# Altium schematic sheet RF_FrontEnd.SchDoc
size A4; SheetNumber: 4; SheetTotal: 4
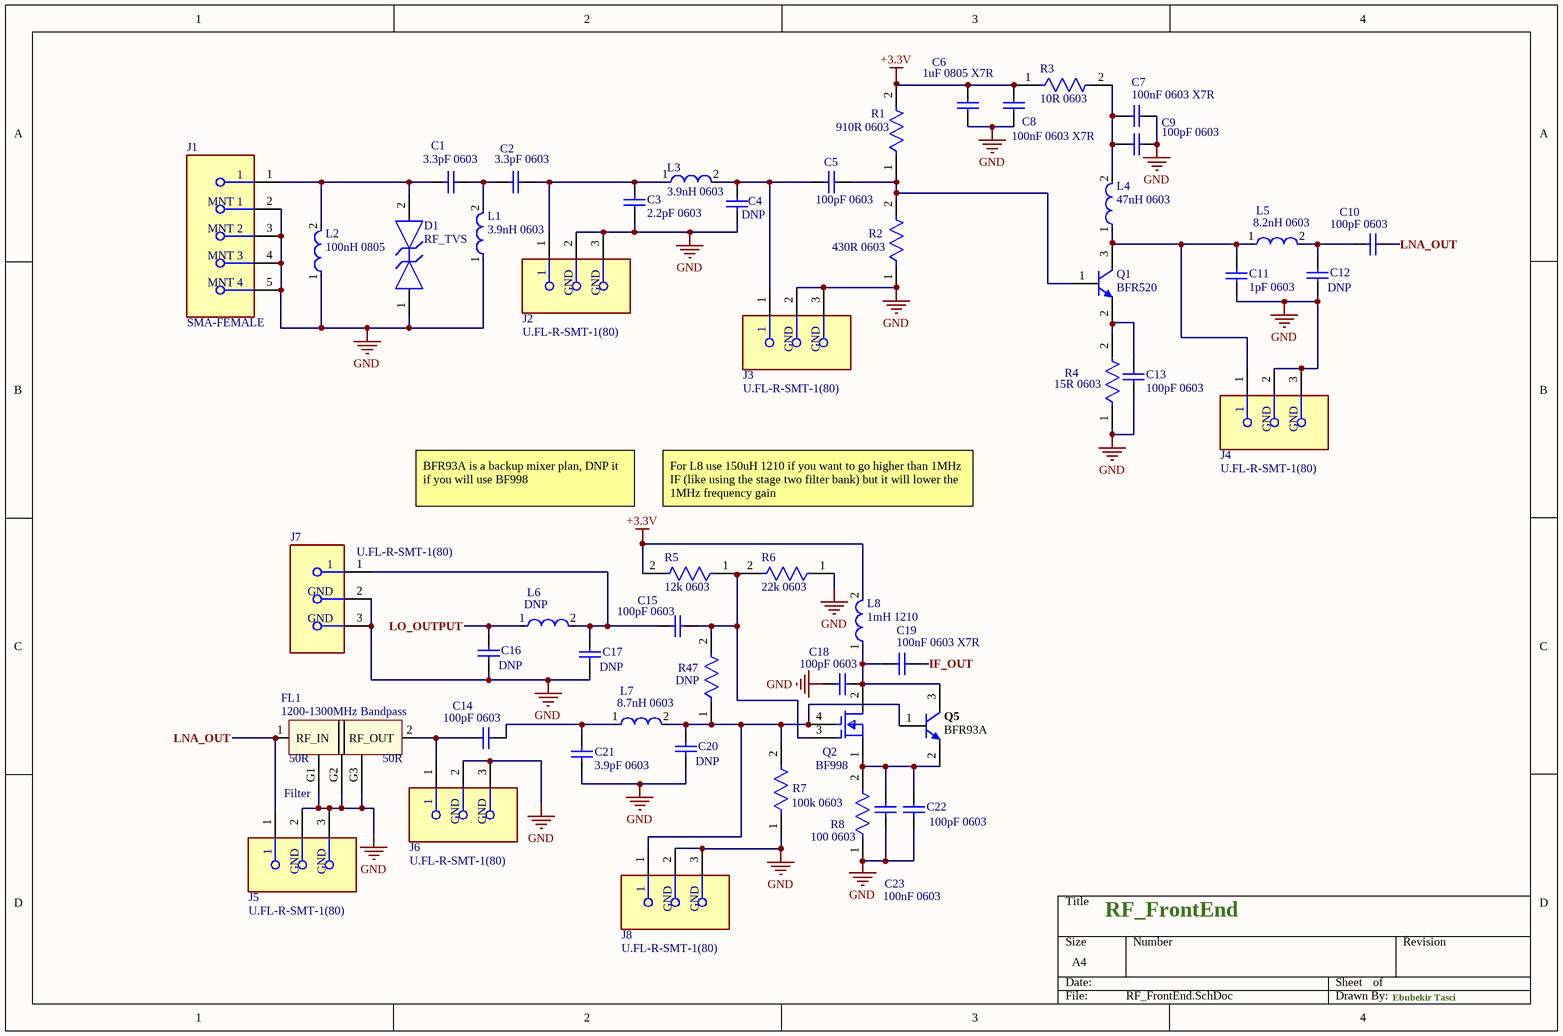
[diagram p0: RF_FrontEnd.SchDoc]

## Parts
C1  3.3pF 0603  [CAPC0603(1608)100_L]
C2  3.3pF 0603  [CAPC0603(1608)100_L]
C3  2.2pF 0603  [CAPC0603(1608)100_L]
C4  DNP  [CAPC0603(1608)100_L]
C5  100pF 0603  [CAPC1608X92X38LL15T08]
C6  1uF 0805 X7R  [CAPC2013X145X50NL20T20]
C7  100nF 0603 X7R  [CAPC1608X92X38NL15T08]
C8  100nF 0603 X7R  [CAPC1608X92X38NL15T08]
C9  100pF 0603  [CAPC1608X92X38LL15T08]
C10  100pF 0603  [CAPC1608X92X38LL15T08]
C11  1pF 0603  [CAPC0603(1608)100_L]
C12  DNP  [CAPC0603(1608)100_L]
C13  100pF 0603  [CAPC1608X92X38LL15T08]
C14  100pF 0603  [CAPC1608X92X38LL15T08]
C15  100pF 0603  [CAPC1608X92X38LL15T08]
C16  DNP  [CAPC0603(1608)100_L]
C17  DNP  [CAPC0603(1608)100_L]
C18  100pF 0603  [CAPC1608X92X38LL15T08]
C19  100nF 0603 X7R  [CAPC1608X92X38NL15T08]
C20  DNP  [CAPC0603(1608)100_L]
C21  3.9pF 0603  [CAPC0603(1608)100_L]
C22  100pF 0603  [CAPC1608X92X38LL15T08]
C23  100nF 0603  [CAPC0603(1608)100_L]
D1  RF_TVS  [FP-152AF-MFG]
FL1  Filter  [PCBComponent_1]  (net tie, no BOM)
J1  SMA-FEMALE  [FP-CON-SMA-EDGE-S-MFG]
J2  U.FL-R-SMT-1(80)  [FP-U_FL-R-SMT-1_80-MFG]
J3  U.FL-R-SMT-1(80)  [FP-U_FL-R-SMT-1_80-MFG]
J4  U.FL-R-SMT-1(80)  [FP-U_FL-R-SMT-1_80-MFG]
J5  U.FL-R-SMT-1(80)  [FP-U_FL-R-SMT-1_80-MFG]
J6  U.FL-R-SMT-1(80)  [FP-U_FL-R-SMT-1_80-MFG]
J7  U.FL-R-SMT-1(80)  [FP-U_FL-R-SMT-1_80-MFG]
J8  U.FL-R-SMT-1(80)  [FP-U_FL-R-SMT-1_80-MFG]
L1  3.9nH 0603  [FP-AISC-0603HP-MFG]
L2  100nH 0805  [FP-LQW2BAN_00-MFG]
L3  3.9nH 0603  [FP-AISC-0603HP-MFG]
L4  47nH 0603  [FP-LQW18AN_80-MFG]
L5  8.2nH 0603  [FP-AISC-0603HP-MFG]
L6  DNP  [FP-AISC-0603HP-MFG]
L7  8.7nH 0603  [FP-AISC-0603HP-MFG]
L8  1mH 1210  [FP-CB3225-IPC_B]
Q1  BFR520  [ONSC-SOT-23-3-318-08_V]
Q2  BF998  [FP-PG-SOT143-4-MFG]
Q5  BFR93A  [INF-SOT23_N]
R1  910R 0603  [FP-MCT0603-IPC_A]
R2  430R 0603  [FP-CPF0603-MFG]
R3  10R 0603  [FP-SR0603-MFG]
R4  15R 0603  [FP-CPF0603-MFG]
R5  12k 0603  [FP-MCT0603-IPC_A]
R6  22k 0603  [FP-MCT0603-IPC_A]
R7  100k 0603  [FP-CPF0603-MFG]
R8  100 0603  [FP-CPF0603-MFG]
R47  DNP  [FP-CPF0603-MFG]

## Nets
+3.3V: C6.2 C8.2 L8.2 R1.2 R3.1 R5.2
GND: C3.1 C4.1 C6.1 C7.1 C8.1 C9.2 C11.1 C12.1 C13.1 C16.1 C17.1 C18.1 C20.1 C21.1 C22.1 C23.1 D1.1 FL1.G1 FL1.G2 FL1.G3 J1.2(MNT_1) J1.3(MNT_2) J1.4(MNT_3) J1.5(MNT_4) J2.2(GND) J2.3(GND) J3.2(GND) J3.3(GND) J4.2(GND) J4.3(GND) J5.2(GND) J5.3(GND) J6.2(GND) J6.3(GND) J7.2(GND) J7.3(GND) J8.2(GND) J8.3(GND) L1.1 L2.1 R2.1 R4.1 R6.1 R7.1 R8.1
IF_OUT: C19.1
LNA_OUT: C10.2 FL1.1(RF_IN) J5.1
LO_OUTPUT: C16.2 L6.1
NetC1_1: C1.1 D1.2 J1.1 L2.2
NetC1_2: C1.2 C2.1 L1.2
NetC2_2: C2.2 C3.2 J2.1 L3.1
NetC4_2: C4.2 C5.1 J3.1 L3.2
NetC5_2: C5.2 Q1.1(B) R1.1 R2.2
NetC7_2: C7.2 C9.1 L4.2 R3.2
NetC10_1: C10.1 C12.2 L5.2
NetC11_2: C11.2 J4.1 L4.1 L5.1 Q1.3(C)
NetC13_2: C13.2 Q1.2(E) R4.2
NetC14_1: C14.1 FL1.2(RF_OUT) J6.1
NetC14_2: C14.2 C21.2 L7.1
NetC15_1: C15.1 C17.2 J7.1 L6.2
NetC15_2: C15.2 Q2.3(G2) R5.1 R6.2 R47.2
NetC18_2: C18.2 C19.2 L8.1 Q2.2(D) Q5.3(C)
NetC20_2: C20.2 J8.1 L7.2 Q2.4(G1) Q5.1(B) R7.2 R47.1
NetC22_2: C22.2 C23.2 Q2.1(S) Q5.2(E) R8.2

## Notes on the sheet
- BFR93A is a backup mixer plan, DNP it if you will use BF998
- For L8 use 150uH 1210 if you want to go higher than 1MHz IF (like using the stage two filter bank) but it will lower the 1MHz frequency gain
- RF_FrontEnd
- Ebubekir Tasci
- (in symbol Component_1) 1200-1300MHz Bandpass; 50R

## Library data of the parts
C1 C2 = CMP-1035-00228-1: CAP 3.3pF 16V ±0.1pF 0603 (1608 Metric) Thickness 1mm SMD; Case-EIA: 0603; Tolerance: Â±0.1pF; Case-Metric: 1608; Max Thickness: 1 mm; Technology: SMT; Value: 3.3pF; Rated Voltage: 16 V
C3 = CMP-1035-00228-1: CAP 2.2pF 16V ±0.1pF 0603 (1608 Metric) Thickness 1mm SMD; Case-EIA: 0603; Tolerance: Â±0.1pF; Case-Metric: 1608; Max Thickness: 1 mm; Technology: SMT; Value: 2.2pF; Rated Voltage: 16 V
C4 C12 C16 C17 C20 = CMP-1035-00228-1: 0603 Extra Pad; Case-EIA: 0603; Case-Metric: 1608; Max Thickness: 1 mm; Technology: SMT
C5 C9 C10 C13-C15 C18 C22 = CMP-2006-01182-1: Manufacturer: Vitramon; Part Number: VJ0603A101FXAAC
C6 = CMP-2007-01676-1: Part Number: VJ0805Y105KXQRW1BC; Manufacturer: Vitramon
C7 C8 C19 = CMP-2006-01166-1: Manufacturer: Vitramon; Part Number: VJ0603Y104KXXAP
C11 = CMP-1035-00228-1: CAP 1pF 16V ±0.1pF 0603 (1608 Metric) Thickness 1mm SMD; Case-EIA: 0603; Tolerance: Â±0.1pF; Case-Metric: 1608; Max Thickness: 1 mm; Technology: SMT; Value: 1pF; Rated Voltage: 16 V
C21 = CMP-1035-00228-1: CAP 3.9pF 16V ±0.1pF 0603 (1608 Metric) Thickness 1mm SMD; Case-EIA: 0603; Tolerance: Â±0.1pF; Case-Metric: 1608; Max Thickness: 1 mm; Technology: SMT; Value: 3.9pF; Rated Voltage: 16 V
C23 = CMP-1035-00228-1: CAP 100nF 16V ±0.1pF 0603 (1608 Metric) Thickness 1mm SMD; Case-EIA: 0603; Tolerance: Â±0.1pF; Case-Metric: 1608; Max Thickness: 1 mm; Technology: SMT; Value: 100nF; Rated Voltage: 16 V
D1 = CMP-07200-000010-1: TVS DIODE 5.3V 14V 2X3DFN / SZESD8472MUT5G; Number of Bidirectional Channels: 1; Element Configuration: Single; Capacitance: 0.3pF; Peak Pulse Current: 3A; Power Line Protection: No; Min Breakdown Voltage: 7V; Direction: Bidirectional; Case/Package: DFN; Lead Free: Lead Free; Reverse Standoff Voltage: 5.3V; Clamping Voltage: 14V; Resistor Type: Zener; Packaging: Tape and Reel; Mount: Surface Mount; Number of Pins: 2; Max Operating Temperature: 150°C; Min Operating Temperature: -55°C; Working Voltage: 5.3V; RoHS Compliant: Yes
FL1 = Component_1
J1 = CMP-204357-000001-1: CONN SMA JACK STR EDGE MNT; Manufacturer Part Number: CON-SMA-EDGE-S; Manufacturer: RF Solutions Ltd.; Impedance: 50Ω; Conn Orientation: Right Angle; Is Female: yes; Number Of Contacts: 1; Frequency: 18GHz; Shielding: true; Category: Conn; ComponentLink2URL: https://www.rfsolutions.co.uk/downloads/1498648656DS-CON-EDGE-SMA-4.pdf; Octopart: https://octopart.com/con-sma-edge-s-rf+solutions-70967450; Package: CONN_JACK; Height: 6.35mm; Device Class L1: Connectors; Footprint Url: https://forum.upverter.com/uploads/default/original/3X/b/e/be75b907af57498775929d6d9099689c472e0307.pdf; Contact Material: Gold; ComponentLink2Description: Datasheet; Device Class L2: RF / Coaxial Connectors; RoHS: TRUE; Device Class L3: unset; Digikey Description: CONN SMA JACK STR EDGE MNT; Lead Free: Yes; Automotive: No
J2-J8 = CMP-11598-000004-1: CONN U.FL RCPT STR 50 OHM SMD; Mating Cycles: 30; Impedance: 50R; Body Plating: Silver; Center Contact Plating: Gold; Body Material: Bronze; Dielectric Material: Polymer; Connector Type: Receptacle; Number of Ports: 1; Max Frequency: 6GHz; Mount: Surface Mount; Termination: Solder; Case/Package: SMD/SMT; Min Operating Temperature: -40°C; Series: U.FL; Max Operating Temperature: 90°C; Fastening Type: SNAP-ON; RoHS Compliant: Yes; Packaging: Tape and Reel; Package Quantity: 10000; Contact Material: Brass; Housing Color: Beige; Lead Free: Lead Free
L1 L3 = CMP-27750-000002-1: FIXED IND 3.9NH SMD; Shielding: Unshielded; Inductance: 3.9nH.; RoHS Compliant: Yes; Case Code (Metric): 1608; Package Quantity: 1; Packaging: Tape and Reel; Termination: SMD/SMT; Case Code (Imperial): 0603; Width: 1.12mm; Length: 0.071inch; Case/Package: 0603; Mount: Surface Mount
L2 = CMP-06042-011478-1: Wire Wound RF Inductor 100nH ±2% 400mA 0.46Ω 0805 (2015); Test Frequency: 150MHz; DC Resistance (DCR): 460mR; Shielding: Unshielded; Self Resonant Frequency: 1.25GHz; Min Operating Temperature: -40°C; Package Quantity: 2000; Length: 0.082inch; Current Rating: 400mA; Tolerance: 2%; Inductance: 100nH; Case/Package: 0805; Resistor Type: Wirewound; Packaging: Tape and Reel; Mount: Surface Mount; Width: 0.06inch; Max Operating Temperature: 85°C; Height - Seated (Max): 0.061inch
L4 = CMP-06042-004994-1: Wire Wound RF Inductor 47nH ±2% 830mA 0.23Ω 0603 (1608); Test Frequency: 100MHz; Shielding: Unshielded; DC Resistance (DCR): 230mR; Self Resonant Frequency: 2.7GHz; Height - Seated (Max): 0.039inch; Tolerance: 2%; Package Quantity: 4000; Width: 0.035inch; Inductance: 47nH; Resistor Type: Wirewound; Mount: Surface Mount; Case/Package: 0603; Min Operating Temperature: -55°C; Length: 0.065inch; Packaging: Tape and Reel; Max Operating Temperature: 125°C; Current Rating: 830mA
L5 = CMP-27750-000002-1: FIXED IND 8.2NH SMD; Shielding: Unshielded; Core Material: Ceramic; Tolerance: 5%; Height - Seated (Max): 0.04inch; RoHS Compliant: Yes; Height: 1.02mm; Case Code (Metric): 1608; Inductance: 8.2nH; Package Quantity: 1; Packaging: Tape and Reel; Min Operating Temperature: -40°C; Termination: SMD/SMT; Case Code (Imperial): 0603; Width: 1.12mm; Length: 0.071inch; Case/Package: 0603; Mount: Surface Mount
L6 = CMP-27750-000002-1: Height - Seated (Max): 0.04inch; RoHS Compliant: Yes; Height: 1.02mm; Case Code (Metric): 1608; Package Quantity: 1; Packaging: Tape and Reel; Termination: SMD/SMT; Case Code (Imperial): 0603; Width: 1.12mm; Length: 0.071inch; Case/Package: 0603; Mount: Surface Mount
L7 = CMP-27750-000002-1: FIXED IND 8.7NH SMD; Shielding: Unshielded; Inductance: 8.2nH; Core Material: Ceramic; Tolerance: 5%; Height - Seated (Max): 0.04inch; RoHS Compliant: Yes; Height: 1.02mm; Case Code (Metric): 1608; Package Quantity: 1; Packaging: Tape and Reel; Min Operating Temperature: -40°C; Termination: SMD/SMT; Case Code (Imperial): 0603; Width: 1.12mm; Length: 0.071inch; Case/Package: 0603; Mount: Surface Mount
L8 = CMP-14484-000068-1: SMD Inductors 1000uH ±10% 0.1A 16.9Ω 1210; Self Resonant Frequency: 1.6MHz; Saturation Current: 100mA; Shielding: Unshielded; Core Material: Ferrite; Test Frequency: 100kHz; DC Resistance (DCR): 13R; Min Operating Temperature: -40°C; Inductance: 1mH; Tolerance: 10%; Length: 0.126inch; Height: 2.5mm; Depth: 2.7mm; Termination: SMD/SMT; Series: CB; Package Quantity: 1000; RoHS Compliant: Yes; Height - Seated (Max): 0.106inch; Packaging: Tape and Reel; Radiation Hardening: No; Current Rating: 100mA; Halogen Free: Halogen Free; Case/Package: 1210; Max DC Current: 100mA; Case Code (Metric): 3225; Width: 0.098inch; Lead Free: Lead Free; Mount: Surface Mount; Max Operating Temperature: 105°C; Case Code (Imperial): 1210; Resistor Type: Wirewound
Q1 = CMP-1048-00596-1: VHF / UHF Transistor, NPN Silicon, 3-Pin SOT-23, Pb-Free, Tape and Reel; ComponentLink1Description: Manufacturer URL; RoHS: TRUE; Packing: Tape and Reel; ComponentLink2URL: http://www.onsemi.cn/pub_link/Collateral/MMBTH10LT1-D.PDF; ComponentLink3URL: http://www.onsemi.cn/pub_link/Collateral/318-08.PDF; DatasheetVersion: Rev. 5; ComponentLink3Description: Package Specification; PackageReference: SOT-23-3-318-08; Mounting Technology: Surface Mount; ComponentLink1URL: http://www.onsemi.com/; Polarity: NPN; PackageDescription: 3-Pin Small Outline Transistor, Body 2.92 x 1.3 mm, Pitch 0.95 mm; ComponentLink2Description: Datasheet
Q2 = CMP-32901-000171-1: MOSFET N-CH 12V 200MA SOT-143; Max Power Dissipation: 200mW; Number of Elements: 1; Max Frequency: 1GHz; Continuous Drain Current (ID): 30mA; Gate to Source Voltage (Vgs): 10V; Mount: Surface Mount; Min Operating Temperature: -55°C; Packaging: Tape and Reel; Contact Plating: Tin; Halogen Free: Not Halogen Free; Number of Pins: 4; Radiation Hardening: No; Case/Package: SOT; Max Operating Temperature: 150°C; Lead Free: Lead Free
Q5 = CMP-1189-00004-1: NPN Silicon RF Transistor, 12 V VCEO, 90 mA IC, 14.5 dB Gmax, SOT23, Green; Manufacturer: Infineon; Ptot (max): 300.0mW; VCEO (max): 12 V; Green: yes; Gmax (typ): 14.5 dB; IC (max): 90 mA; NFmin (typ): 1.5 dB; Group: For low frequencies, e.g. VHF/UHF; Mounting Technology: Surface Mount; PartNumber: BFR93A; ComponentLink3Description: Package Specification; ComponentLink2URL: http://www.infineon.com/dgdl/bfr93a.pdf?folderId=db3a30431400ef68011425b1354605c1&fileId=db3a30431400ef6801142702189806ae&location=en.Products.RF.RF_Transistors_.High_Linearity_Si-_and_SiGe_C-Transistors_for_use_up_to_6_GHz.DATASHEET.bfr93a.pdf; DatasheetVersion: Aug-2012; ComponentLink3URL: http://www.infineon.com/dgdl/SOT23-Package_Overview.pdf?folderId=db3a30431936bc4b0119532290053c66&fileId=db3a30431936bc4b0119533468123c85; ComponentLink1URL: http://www.infineon.com/; PackageDescription: 3-Pin Small Outline Transistor Package, 1.3 x 2.9 mm Body, 0.95 mm Pitch; PackageReference: SOT23; ComponentLink2Description: Datasheet; ComponentLink1Description: Manufacturer URL
R1 = CMP-02407-005940-1: RES SMD 910 OHM 1% 1/8W 0603; Composition: Thin Film; Depth: 0.85mm; Min Operating Temperature: -55°C; Military Standard: Not; Length: 1.55mm; Max Operating Temperature: 125°C; Tolerance: 1%; Resistance: 910R; Lead Free: Lead Free; Case/Package: 0603; Packaging: Tape and Reel
R2 = CMP-03211-006902-1: RES SMD 430Ω 0.1% 1/16W 0603; Manufacturer Part Number: CPF0603B430RE1; Manufacturer: TE Connectivity; Power Rating: 0.063W; Temperature Coefficient: 25ppm/°C; Voltage Rating: 50V; Lead Free: Yes; Temperature: -55°C to +155°C; Device Class L3: Chip SMD Resistors; RoHS: TRUE; packaging: 1k Reel; ComponentLink2Description: Datasheet; Category: Res; Resistance: 430Ω; Octopart: https://octopart.com/cpf0603b430re1-te+connectivity-22738753; Automotive: No; Height: 0.55mm; Package: CPF0603; octopart_url: https://octopart.com/cpf0603b430re1-te+connectivity-22738753; ComponentLink2URL: https://www.te.com/commerce/DocumentDelivery/DDEController?Action=showdoc&DocId=Data+Sheet%7F1773200%7FM%7Fpdf%7FEnglish%7FENG_DS_1773200_M.pdf%7F3-1676481-2; Series: CPF; Composition: Thin Film; Device Class L2: Resistors; Tolerance: 0.1%; Ipc Land Pattern Name: RESC15580X45; Value: 430Ω; Device Class L1: Passive Components; Temperature Range High: +155°C; Temperature Range Low: -55°C
R3 = CMP-03412-016018-1: RES SMD 0603 1/4W 1% 10 OHM; Manufacturer Part Number: SR0603FR-7T10RL; Manufacturer: Yageo; Voltage Rating: 75V; Value: 10Ω; Tolerance: 0.01; Automotive Grade: Grade 0; Power Rating: 0.25W; Footprint Url: http://www.yageo.com/exep/pages/download/literatures/PYu-R_Mount_10.pdf; Digikey Description: RES SMD 0603 1/4W 1% 10 OHM; Device Class L2: Resistors; Octopart: https://octopart.com/sr0603fr-7t10rl-yageo-91478074; Temperature Range Low: -55°C; Device Class L3: Chip SMD Resistors; ComponentLink2Description: Datasheet; Height: 0.55mm; Automotive: Yes; Lead Free: Yes; Category: Res; Resistance: 10Ω; RoHS: TRUE; Series: SR; Temperature: -55°C to +155°C; Device Class L1: Passive Components; Temperature Range High: +155°C; Composition: Thick Film; Package: SR0603; ComponentLink2URL: http://www.yageo.com/documents/recent/PYu-SR_D_F%20tol_RoHS_L_3.pdf; Ipc Land Pattern Name: RESC16080X45
R4 = CMP-03211-011109-1: RES SMD 15Ω 0.1% 1/16W 0603; Manufacturer: TE Connectivity; Manufacturer Part Number: CPF0603B15RE; Power Rating: 0.063W; Temperature Coefficient: 25ppm/°C; Voltage Rating: 50V; Height: 0.55mm; Tolerance: 0.1%; Value: 15Ω; Device Class L1: Passive Components; Temperature Range Low: -55°C; ComponentLink2Description: Datasheet; Device Class L3: Chip SMD Resistors; Package: CPF0603; Device Class L2: Resistors; Series: CPF; Temperature: -55°C to +155°C; packaging: 5k Reel; Temperature Range High: +155°C; Automotive: No; Composition: Thin Film; Ipc Land Pattern Name: RESC15580X45; RoHS: TRUE; ComponentLink2URL: https://www.te.com/commerce/DocumentDelivery/DDEController?Action=showdoc&DocId=Data+Sheet%7F1773200%7FM%7Fpdf%7FEnglish%7FENG_DS_1773200_M.pdf%7F3-1676481-2; Category: Res; Octopart: https://octopart.com/cpf0603b15re-te+connectivity-23283246; Lead Free: Yes; Resistance: 15Ω; octopart_url: https://octopart.com/cpf0603b15re-te+connectivity-23283246
R5 = CMP-02407-005940-1: RES SMD 12 KOHM 1% 1/8W 0603; Composition: Thin Film; Depth: 0.85mm; Min Operating Temperature: -55°C; Military Standard: Not; Length: 1.55mm; Max Operating Temperature: 125°C; Tolerance: 1%; Resistance: 12k; Lead Free: Lead Free; Case/Package: 0603; Packaging: Tape and Reel
R6 = CMP-02407-005940-1: RES SMD 22 KOHM 1% 1/8W 0603; Composition: Thin Film; Depth: 0.85mm; Min Operating Temperature: -55°C; Military Standard: Not; Length: 1.55mm; Max Operating Temperature: 125°C; Tolerance: 1%; Resistance: 22k; Lead Free: Lead Free; Case/Package: 0603; Packaging: Tape and Reel
R7 = CMP-03211-006902-1: RES SMD 100kΩ 0.1% 1/16W 0603; Manufacturer Part Number: CPF0603B430RE1; Manufacturer: TE Connectivity; Power Rating: 0.063W; Temperature Coefficient: 25ppm/°C; Voltage Rating: 50V; Lead Free: Yes; Temperature: -55°C to +155°C; Device Class L3: Chip SMD Resistors; RoHS: TRUE; packaging: 1k Reel; ComponentLink2Description: Datasheet; Category: Res; Resistance: 100kΩ; Octopart: https://octopart.com/cpf0603b430re1-te+connectivity-22738753; Automotive: No; Height: 0.55mm; Package: CPF0603; octopart_url: https://octopart.com/cpf0603b430re1-te+connectivity-22738753; ComponentLink2URL: https://www.te.com/commerce/DocumentDelivery/DDEController?Action=showdoc&DocId=Data+Sheet%7F1773200%7FM%7Fpdf%7FEnglish%7FENG_DS_1773200_M.pdf%7F3-1676481-2; Series: CPF; Composition: Thin Film; Device Class L2: Resistors; Tolerance: 0.1%; Ipc Land Pattern Name: RESC15580X45; Value: 100kΩ; Device Class L1: Passive Components; Temperature Range High: +155°C; Temperature Range Low: -55°C
R8 = CMP-03211-006902-1: RES SMD 100Ω 0.1% 1/16W 0603; Manufacturer Part Number: CPF0603B430RE1; Manufacturer: TE Connectivity; Value: 430Ω; Power Rating: 0.063W; Temperature Coefficient: 25ppm/°C; Voltage Rating: 50V; Lead Free: Yes; Temperature: -55°C to +155°C; Device Class L3: Chip SMD Resistors; RoHS: TRUE; packaging: 1k Reel; ComponentLink2Description: Datasheet; Category: Res; Resistance: 100Ω; Octopart: https://octopart.com/cpf0603b430re1-te+connectivity-22738753; Automotive: No; Height: 0.55mm; Package: CPF0603; octopart_url: https://octopart.com/cpf0603b430re1-te+connectivity-22738753; ComponentLink2URL: https://www.te.com/commerce/DocumentDelivery/DDEController?Action=showdoc&DocId=Data+Sheet%7F1773200%7FM%7Fpdf%7FEnglish%7FENG_DS_1773200_M.pdf%7F3-1676481-2; Series: CPF; Composition: Thin Film; Device Class L2: Resistors; Tolerance: 0.1%; Ipc Land Pattern Name: RESC15580X45; Device Class L1: Passive Components; Temperature Range High: +155°C; Temperature Range Low: -55°C
R47 = CMP-03211-006902-1: DNP 0603; Manufacturer Part Number: CPF0603B430RE1; Manufacturer: TE Connectivity; Resistance: 100kΩ; Tolerance: 0.1%; Value: 100kΩ; Power Rating: 0.063W; Temperature Coefficient: 25ppm/°C; Voltage Rating: 50V; Lead Free: Yes; Temperature: -55°C to +155°C; Device Class L3: Chip SMD Resistors; RoHS: TRUE; packaging: 1k Reel; ComponentLink2Description: Datasheet; Category: Res; Octopart: https://octopart.com/cpf0603b430re1-te+connectivity-22738753; Automotive: No; Height: 0.55mm; Package: CPF0603; octopart_url: https://octopart.com/cpf0603b430re1-te+connectivity-22738753; ComponentLink2URL: https://www.te.com/commerce/DocumentDelivery/DDEController?Action=showdoc&DocId=Data+Sheet%7F1773200%7FM%7Fpdf%7FEnglish%7FENG_DS_1773200_M.pdf%7F3-1676481-2; Series: CPF; Composition: Thin Film; Device Class L2: Resistors; Ipc Land Pattern Name: RESC15580X45; Device Class L1: Passive Components; Temperature Range High: +155°C; Temperature Range Low: -55°C